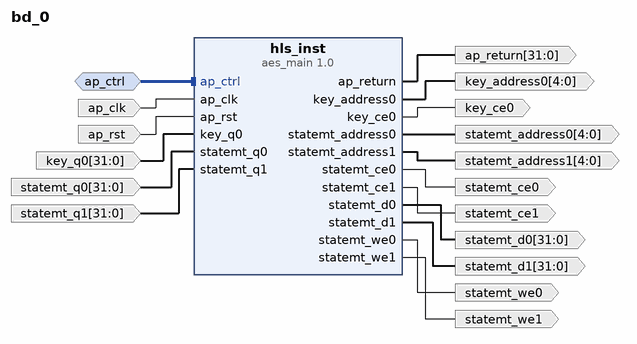
[diagram p0: block diagram of the top level]
# Vivado block design bd_0, xcu50-fsvh2104-2-e, Vivado 2023.2
create_bd_design bd_0

create_bd_intf_port -mode Slave -vlnv xilinx.com:interface:acc_handshake_rtl:1.0 ap_ctrl
create_bd_port -dir I -type clk ap_clk
set_property -dict {CONFIG.FREQ_HZ 125000000.0} [get_bd_ports ap_clk]
create_bd_port -dir O -from 31 -to 0 -type data ap_return
create_bd_port -dir I -type rst ap_rst
set_property -dict {CONFIG.POLARITY ACTIVE_HIGH} [get_bd_ports ap_rst]
create_bd_port -dir O -from 4 -to 0 -type data key_address0
create_bd_port -dir O key_ce0
create_bd_port -dir I -from 31 -to 0 -type data key_q0
create_bd_port -dir O -from 4 -to 0 -type data statemt_address0
create_bd_port -dir O -from 4 -to 0 -type data statemt_address1
create_bd_port -dir O statemt_ce0
create_bd_port -dir O statemt_ce1
create_bd_port -dir O -from 31 -to 0 -type data statemt_d0
create_bd_port -dir O -from 31 -to 0 -type data statemt_d1
create_bd_port -dir I -from 31 -to 0 -type data statemt_q0
create_bd_port -dir I -from 31 -to 0 -type data statemt_q1
create_bd_port -dir O statemt_we0
create_bd_port -dir O statemt_we1

create_bd_cell -type ip -vlnv xilinx.com:hls:aes_main:1.0 hls_inst

# ---- connections ----

connect_bd_intf_net -intf_net ap_ctrl_0_1 [get_bd_intf_ports ap_ctrl] [get_bd_intf_pins hls_inst/ap_ctrl]
connect_bd_net -net ap_clk_0_1 [get_bd_ports ap_clk] [get_bd_pins hls_inst/ap_clk]
connect_bd_net -net ap_rst_0_1 [get_bd_ports ap_rst] [get_bd_pins hls_inst/ap_rst]
connect_bd_net [get_bd_pins hls_inst/ap_return] [get_bd_ports ap_return]
connect_bd_net [get_bd_pins hls_inst/key_address0] [get_bd_ports key_address0]
connect_bd_net [get_bd_pins hls_inst/key_ce0] [get_bd_ports key_ce0]
connect_bd_net [get_bd_pins hls_inst/statemt_address0] [get_bd_ports statemt_address0]
connect_bd_net [get_bd_pins hls_inst/statemt_address1] [get_bd_ports statemt_address1]
connect_bd_net [get_bd_pins hls_inst/statemt_ce0] [get_bd_ports statemt_ce0]
connect_bd_net [get_bd_pins hls_inst/statemt_ce1] [get_bd_ports statemt_ce1]
connect_bd_net [get_bd_pins hls_inst/statemt_d0] [get_bd_ports statemt_d0]
connect_bd_net [get_bd_pins hls_inst/statemt_d1] [get_bd_ports statemt_d1]
connect_bd_net [get_bd_pins hls_inst/statemt_we0] [get_bd_ports statemt_we0]
connect_bd_net [get_bd_pins hls_inst/statemt_we1] [get_bd_ports statemt_we1]
connect_bd_net -net key_q0_0_1 [get_bd_ports key_q0] [get_bd_pins hls_inst/key_q0]
connect_bd_net -net statemt_q0_0_1 [get_bd_ports statemt_q0] [get_bd_pins hls_inst/statemt_q0]
connect_bd_net -net statemt_q1_0_1 [get_bd_ports statemt_q1] [get_bd_pins hls_inst/statemt_q1]

validate_bd_design
save_bd_design
